# Altium schematic sheet motordriver-v3.1_IO.SchDoc
size A
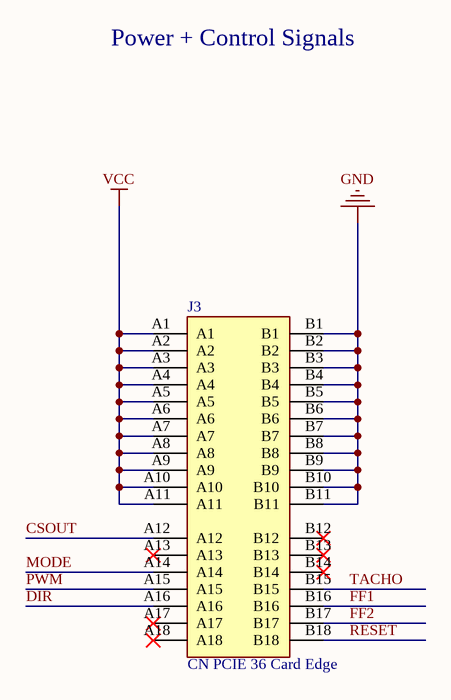
[diagram p0: motordriver-v3.1_IO.SchDoc]

## Parts
J3  CN PCIE 36 Card Edge  [CN PCIE EDGE 36CKT]

## Nets
GND: J3.B1 J3.B2 J3.B3 J3.B4 J3.B5 J3.B6 J3.B7 J3.B8 J3.B9 J3.B10 J3.B11
VCC: J3.A1 J3.A2 J3.A3 J3.A4 J3.A5 J3.A6 J3.A7 J3.A8 J3.A9 J3.A10 J3.A11
CSOUT: J3.A12
DIR: J3.A16
FF1: J3.B16
FF2: J3.B17
MODE: J3.A14
PWM: J3.A15
RESET: J3.B18
TACHO: J3.B15

Not connected (* = marked no-connect by the designer): J3 A13* A17* A18* B12* B13* B14*

## Notes on the sheet
- Power + Control Signals

## Library data of the parts
J3 = CN PCIE 36 Card Edge: 36 Position Male PCIE Connector